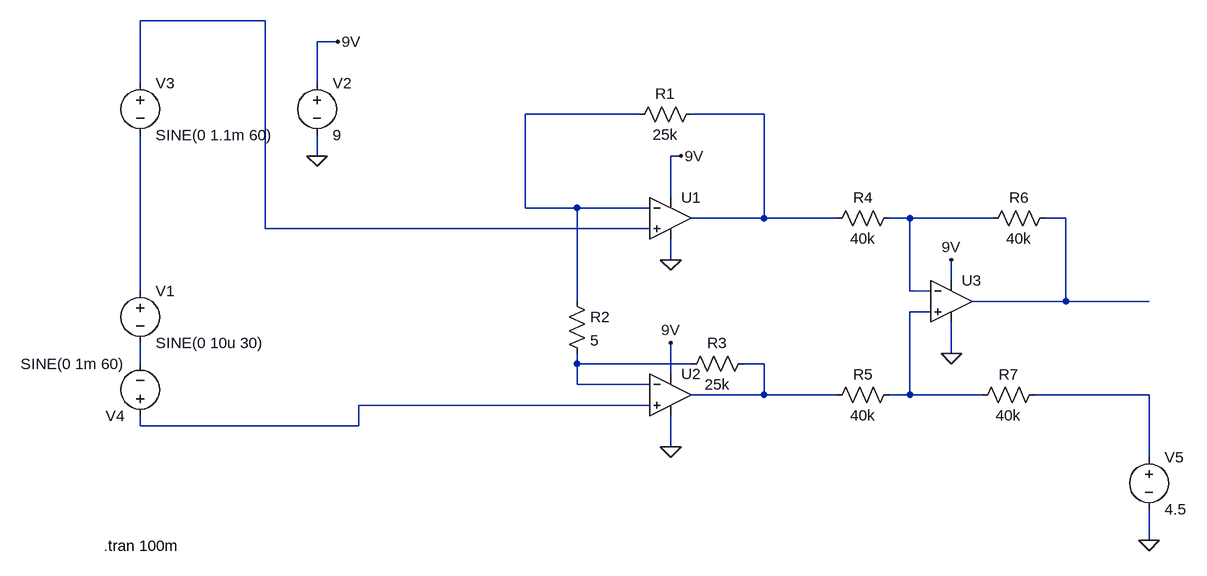
[diagram p0: schematic Instrumentation Amp.asc]
Instrumentation Amp.asc, the LTspice schematic file:
Version 4
SHEET 1 1200 680
WIRE -224 -160 -416 -160
WIRE -112 -128 -144 -128
WIRE -416 -64 -416 -160
WIRE -144 -64 -144 -128
WIRE 352 -16 176 -16
WIRE 544 -16 432 -16
WIRE -144 48 -144 16
WIRE 416 48 400 48
WIRE 400 112 400 48
WIRE 176 128 176 -16
WIRE 256 128 176 128
WIRE 368 128 256 128
WIRE 544 144 544 -16
WIRE 544 144 432 144
WIRE 656 144 544 144
WIRE 768 144 736 144
WIRE 896 144 768 144
WIRE 1008 144 976 144
WIRE -224 160 -224 -160
WIRE 368 160 -224 160
WIRE 400 208 400 176
WIRE 832 240 832 208
WIRE -416 256 -416 16
WIRE 768 256 768 144
WIRE 800 256 768 256
WIRE 256 272 256 128
WIRE 1008 272 1008 144
WIRE 1008 272 864 272
WIRE 1136 272 1008 272
WIRE 800 288 768 288
WIRE 832 352 832 304
WIRE -416 368 -416 336
WIRE 256 368 256 352
WIRE 432 368 256 368
WIRE 544 368 512 368
WIRE 400 384 400 336
WIRE 256 400 256 368
WIRE 368 400 256 400
WIRE 544 416 544 368
WIRE 544 416 432 416
WIRE 656 416 544 416
WIRE 768 416 768 288
WIRE 768 416 736 416
WIRE 880 416 768 416
WIRE 1136 416 960 416
WIRE 368 432 -80 432
WIRE -416 464 -416 448
WIRE -80 464 -80 432
WIRE -80 464 -416 464
WIRE 400 496 400 448
WIRE 1136 512 1136 416
WIRE 1136 640 1136 592
FLAG -144 48 0
FLAG -112 -128 9V
FLAG 416 48 9V
FLAG 400 208 0
FLAG 400 496 0
FLAG 400 336 9V
FLAG 832 208 9V
FLAG 832 352 0
FLAG 1136 640 0
SYMBOL voltage -416 240 R0
WINDOW 123 0 0 Left 0
WINDOW 39 0 0 Left 0
SYMATTR InstName V1
SYMATTR Value SINE(0 10u 30)
SYMBOL OpAmps\\UniversalOpAmp1 400 144 R0
SYMATTR InstName U1
SYMBOL voltage -144 -80 R0
WINDOW 123 0 0 Left 0
WINDOW 39 0 0 Left 0
SYMATTR InstName V2
SYMATTR Value 9
SYMBOL OpAmps\\UniversalOpAmp1 400 416 R0
SYMATTR InstName U2
SYMBOL res 448 -32 R90
WINDOW 0 0 56 VBottom 2
WINDOW 3 32 56 VTop 2
SYMATTR InstName R1
SYMATTR Value 25k
SYMBOL res 240 256 R0
SYMATTR InstName R2
SYMATTR Value 5
SYMBOL res 528 352 R90
WINDOW 0 0 56 VBottom 2
WINDOW 3 32 56 VTop 2
SYMATTR InstName R3
SYMATTR Value 25k
SYMBOL res 752 128 R90
WINDOW 0 0 56 VBottom 2
WINDOW 3 32 56 VTop 2
SYMATTR InstName R4
SYMATTR Value 40k
SYMBOL res 752 400 R90
WINDOW 0 0 56 VBottom 2
WINDOW 3 32 56 VTop 2
SYMATTR InstName R5
SYMATTR Value 40k
SYMBOL OpAmps\\UniversalOpAmp2 832 272 R0
SYMATTR InstName U3
SYMBOL res 992 128 R90
WINDOW 0 0 56 VBottom 2
WINDOW 3 32 56 VTop 2
SYMATTR InstName R6
SYMATTR Value 40k
SYMBOL res 976 400 R90
WINDOW 0 0 56 VBottom 2
WINDOW 3 32 56 VTop 2
SYMATTR InstName R7
SYMATTR Value 40k
SYMBOL voltage -416 -80 R0
WINDOW 123 0 0 Left 0
WINDOW 39 0 0 Left 0
SYMATTR InstName V3
SYMATTR Value SINE(0 1.1m 60)
SYMBOL voltage -416 464 R180
WINDOW 123 0 0 Left 0
WINDOW 39 0 0 Left 0
SYMATTR InstName V4
SYMATTR Value SINE(0 1m 60)
SYMBOL voltage 1136 496 R0
WINDOW 123 0 0 Left 0
WINDOW 39 0 0 Left 0
SYMATTR InstName V5
SYMATTR Value 4.5
TEXT -472 648 Left 2 !.tran 100m

The netlist it stands for:
* Instrumentation Amp.asc
V1 N006 N008 SINE(0 10u 30)
XU1 N001 N002 9V 0 N003 level1 Avol=1Meg GBW=10Meg Vos=0 En=0 Enk=0 In=0 Ink=0 Rin=500Meg  ; pins In+ In- V+ V- OUT
V2 9V 0 9
XU2 N012 N009 9V 0 N010 level1 Avol=1Meg GBW=10Meg Vos=0 En=0 Enk=0 In=0 Ink=0 Rin=500Meg  ; pins In+ In- V+ V- OUT
R1 N003 N002 25k
R2 N002 N009 5
R3 N010 N009 25k
R4 N004 N003 40k
R5 N007 N010 40k
XU3 N007 N004 9V 0 N005 level2 Avol=1Meg GBW=10Meg Slew=10Meg Ilimit=25m Rail=0 Vos=0 En=0 Enk=0 In=0 Ink=0 Rin=500Meg  ; pins In+ In- V+ V- OUT
R6 N005 N004 40k
R7 N011 N007 40k
V3 N001 N006 SINE(0 1.1m 60)
V4 N012 N008 SINE(0 1m 60)
V5 N011 0 4.5
.tran 100m
.lib UniversalOpAmp1.lib
.lib UniversalOpAmp2.lib
.backanno
.end